# Altium schematic sheet Sch_RoverLite_v1.SchDoc
size A
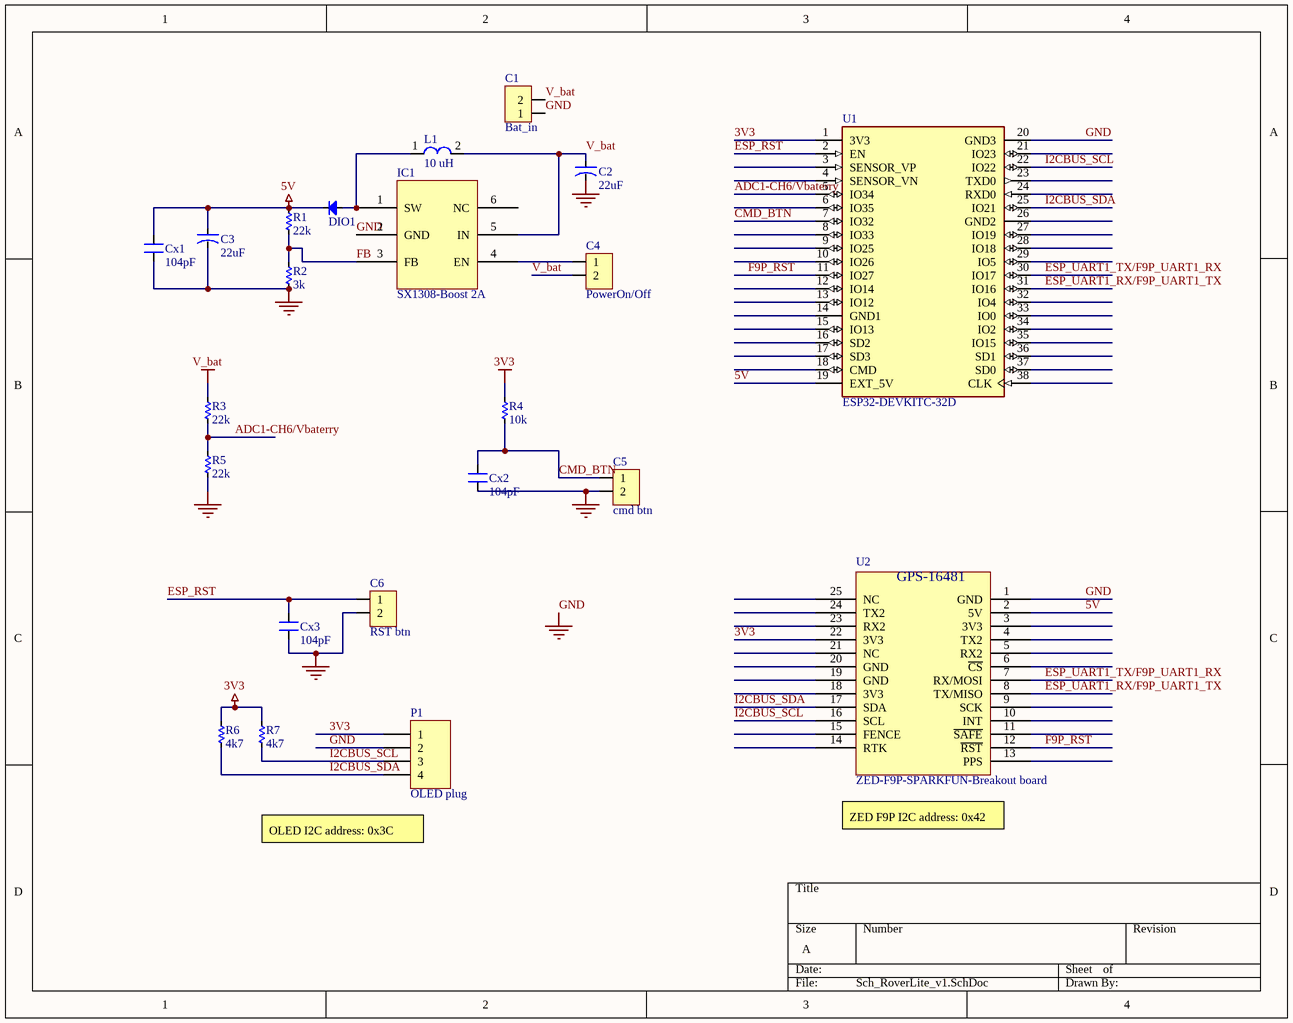
[diagram p0: Sch_RoverLite_v1.SchDoc]

## Parts
C1  Bat_in  [HDR2]
C2  22uF  [CAP-ALU-SMD-6.3x7.7x2.2]
C3  22uF  [CAP-ALU-SMD-6.3x7.7x2.2]
C4  PowerOn/Off  [HDR2]
C5  cmd btn  [HDR2]
C6  RST btn  [HDR2]
Cx1  104pF  [CN-SMD-1206]
Cx2  104pF  [CN-SMD-0805]
Cx3  104pF  [CN-SMD-0805]
DIO1  SS34  [DIO-SMD-216AA]  (value not drawn)
IC1  SX1308-Boost 2A  [SX1308fpt]
L1  10 uH  [L-SMD-M-7.3x4.5]
P1  OLED plug  [HDR1X4]
R1  22k  [RES-SMD-0805]
R2  3k  [RES-SMD-0805]
R3  22k  [RES-SMD-0805]
R4  10k  [RES-SMD-0805]
R5  22k  [RES-SMD-0805]
R6  4k7  [RES-SMD-0805]
R7  4k7  [RES-SMD-0805]
U1  ESP32-DEVKITC-32D  [MODULE_ESP32-DEVKITC-32D]
U2  ZED-F9P-SPARKFUN-Breakout board  [GPS-16481]

## Nets
3V3: P1.1 R4.1 R6.1 R7.1 U1.1(3V3) U2.22(3V3)
5V: C3.1 Cx1.2 DIO1.2(K) R1.1 U1.19(EXT_5V) U2.2(5V)
GND: C1.1 C2.2 C3.2 C5.2 C6.2 Cx1.1 Cx2.1 Cx3.1 IC1.2(GND) P1.2 R2.2 R5.2 U1.20(GND3) U2.1(GND)
V_bat: C1.2 C2.1 C4.2 IC1.5(IN) L1.2 R3.1
ADC1-CH6/Vbaterry: R3.2 R5.1 U1.5(IO34)
CMD_BTN: C5.1 Cx2.2 R4.2 U1.7(IO32)
ESP_RST: C6.1 Cx3.2 U1.2(EN)
ESP_UART1_RX/F9P_UART1_TX: U1.31(IO16) U2.8(TX/MISO)
ESP_UART1_TX/F9P_UART1_RX: U1.30(IO17) U2.7(RX/MOSI)
F9P_RST: U1.11(IO27) U2.12(~{RST})
FB: IC1.3(FB) R1.2 R2.1
I2CBUS_SCL: P1.3 R7.2 U1.22(IO22) U2.16(SCL)
I2CBUS_SDA: P1.4 R6.2 U1.25(IO21) U2.17(SDA)
NetC4_1: C4.1 IC1.4(EN)
NetDIO1_1: DIO1.1(A) IC1.1(SW) L1.1

Not connected (* = marked no-connect by the designer): IC1 6(NC); U1 3(SENSOR_VP) 4(SENSOR_VN) 6(IO35) 8(IO33) 9(IO25) 10(IO26) 12(IO14) 13(IO12) 14(GND1) 15(IO13) 16(SD2) 17(SD3) 18(CMD) 21(IO23) 23(TXD0) 24(RXD0) 26(GND2) 27(IO19) 28(IO18) 29(IO5) 32(IO4) 33(IO0) 34(IO2) 35(IO15) 36(SD1) 37(SD0) 38(CLK); U2 3(3V3) 4(TX2) 5(RX2) 6(~{CS}) 9(SCK) 10(INT) 11(~{SAFE}) 13(PPS) 14(RTK) 15(FENCE) 18(3V3) 19(GND) 20(GND) 21(NC) 23(RX2) 24(TX2) 25(NC)

## Notes on the sheet
- (near P1) OLED I2C address: 0x3C
- (near U2) ZED F9P I2C address: 0x42
- (in symbol ZED-F9P-SPARKFUN-Breakout board) GPS-16481

## Library data of the parts
C1 C4-C6 = Header2: Header IDC, 2 x 1 Pin Vertical 2.54mm Pitch (Non-Boxed, Male); Manufacturer: W¨¹rth Elektronik eiSos GmbH; partNo: 613002143121; ComponentLink1 Description: Manufacturer; ComponentLink2 Description: Datasheet; NoPins: 02; Created Date: 29 March 2013; ComponentLink1URL: http://www.we-online.com; ComponentLink2URL: http://katalog.we-online.de/em/datasheet/6130xx143121.pdf; Created by: Karrer Zheng
C2 C3 = CN-ALU-SMD: Polarized Capacitor (Axial); Published: 8-Jun-2000; LatestRevisionDate: 17-Jul-2002; LatestRevisionNote: Re-released for DXP Platform.; PackageReference: POLAR0.8; Publisher: Altium Limited
Cx1-Cx3 = CN: Value: 33pF
DIO1 = Diode SMD: Default Diode; Code - JEDEC: DO-214-AB; Value: 1N5007; Published: 8-Jun-2000; Revision: July-2002: Re-released for DXP Platform.; Publisher: Altium Limited
L1 = L-SMD-1: partNo: 78477010; Manufacturer: Wurth Elektronik; Inductance: 1.0 μH; ComponentLink1Description: Manufacturer; ComponentLink1URL: http://www.we-online.de; Created by: Baojun Chen; Created Date: Nov.2015; ComponentLink2Description: Datasheet; ComponentLink2URL: http://katalog.we-online.de/pbs/datasheet/78477010.pdf
P1 = Header 4: Header, 4-Pin; LatestRevisionDate: 17-Jul-2002; LatestRevisionNote: Re-released for DXP Platform.; Publisher: Altium Limited
R1-R7 = Res-SMD: Resistor; Manufacturer: Generic Components; Class: Passive; Published: 08/06/2000; Publisher: Altium Hobart Technology Centre
U1 = ESP32-DEVKITC-32D: EVAL BOARD FOR ESP-WROOM-32; MF: Espressif Systems; Value: *; MP: ESP32-DEVKITC-32D; Price: None; Check_prices: https://www.snapeda.com/parts/ESP32-DEVKITC-32D/Espressif%20Systems/view-part/2777395/?ref=eda; SnapEDA_Link: https://www.snapeda.com/parts/ESP32-DEVKITC-32D/Espressif%20Systems/view-part/2777395/?ref=snap; Availability: Warning; Purchase-URL: https://pricing.snapeda.com/search/part/ESP32-DEVKITC-32D/?ref=eda; Package: None